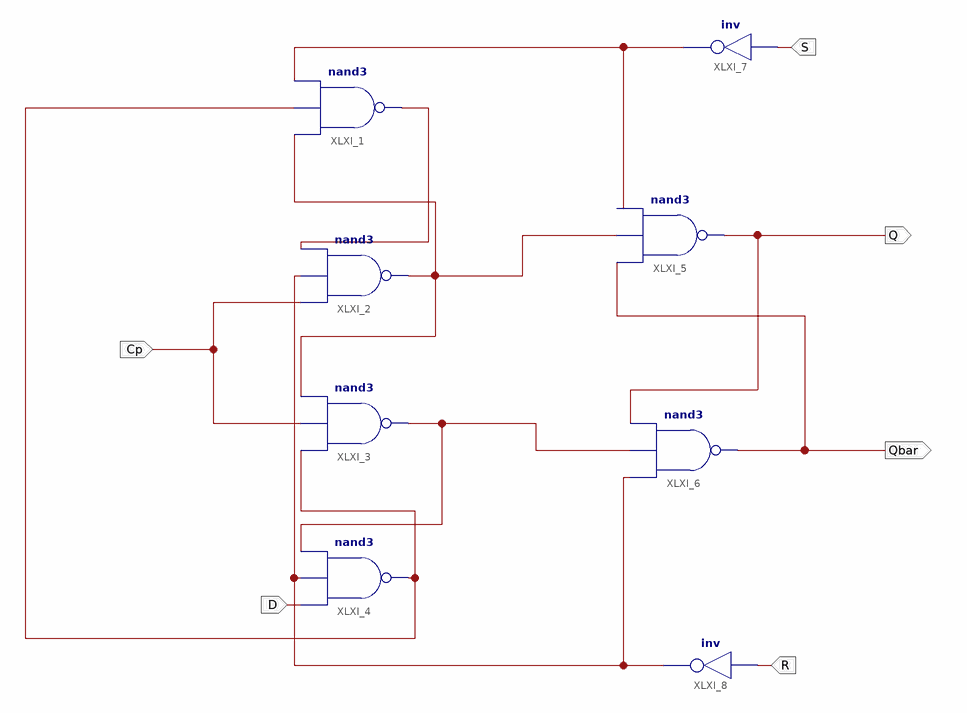
[diagram p0: schematic sheet 1]
// Xilinx ISE schematic D_FLIPFLOP.sch (kintex7) as structural Verilog: 8 symbols, 6 ports
module D_FLIPFLOP (
  input  Cp,
  input  D,
  input  S,
  input  R,
  output Q,
  output Qbar
);

  wire XLXN_1, XLXN_2, XLXN_3, XLXN_4, XLXN_10, XLXN_13;

  nand XLXI_1 (XLXN_1, XLXN_2, XLXN_4, XLXN_13);
  nand XLXI_2 (XLXN_2, Cp, XLXN_10, XLXN_1);
  nand XLXI_3 (XLXN_3, XLXN_4, Cp, XLXN_2);
  nand XLXI_4 (XLXN_4, D, XLXN_10, XLXN_3);
  nand XLXI_5 (Q, Qbar, XLXN_2, XLXN_13);
  nand XLXI_6 (Qbar, XLXN_10, XLXN_3, Q);
  not XLXI_7 (XLXN_13, S);
  not XLXI_8 (XLXN_10, R);
endmodule
